# EasyEDA schematic SCH_JamSoftElectronULA.json

## Sheets
1 Power: TITLE: POWER; REV: 3.1; Date: 2024-04-19; Sheet: 1/3; Drawn By: Chris Jamieson; Company: JamSoft
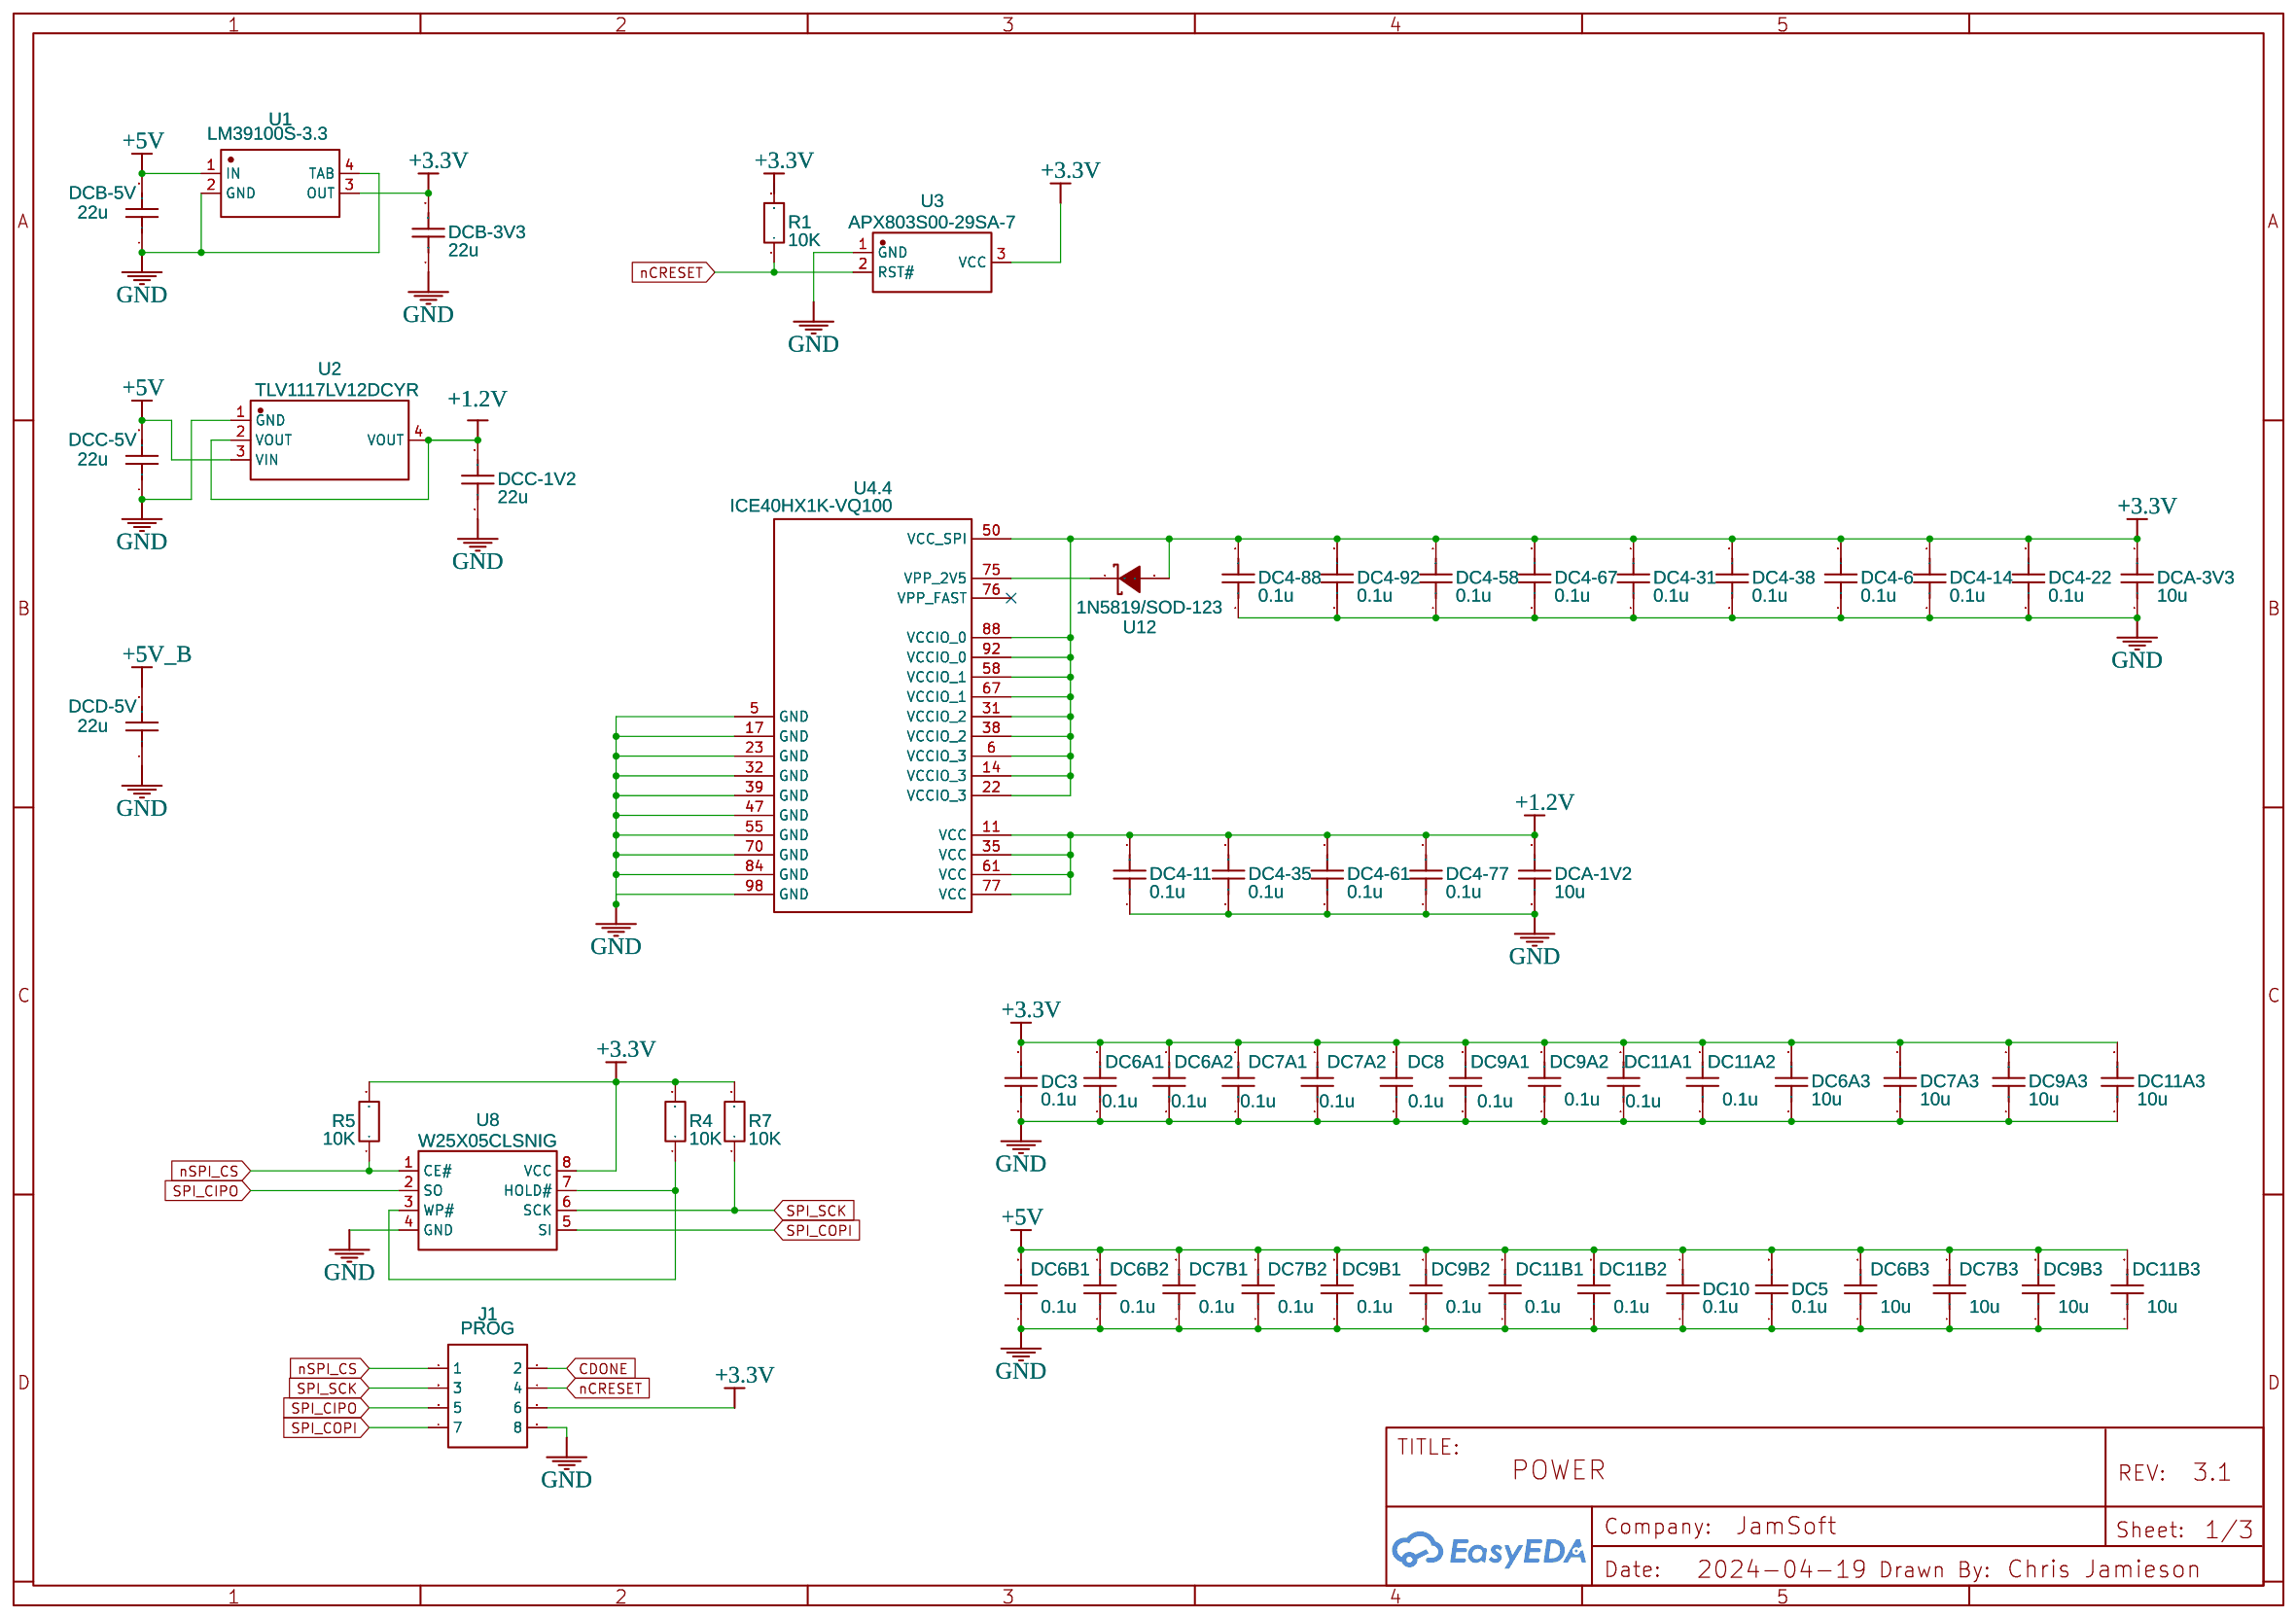
[diagram p0: Power]
2 ULA1: TITLE: ULA1; Sheet: 2/3
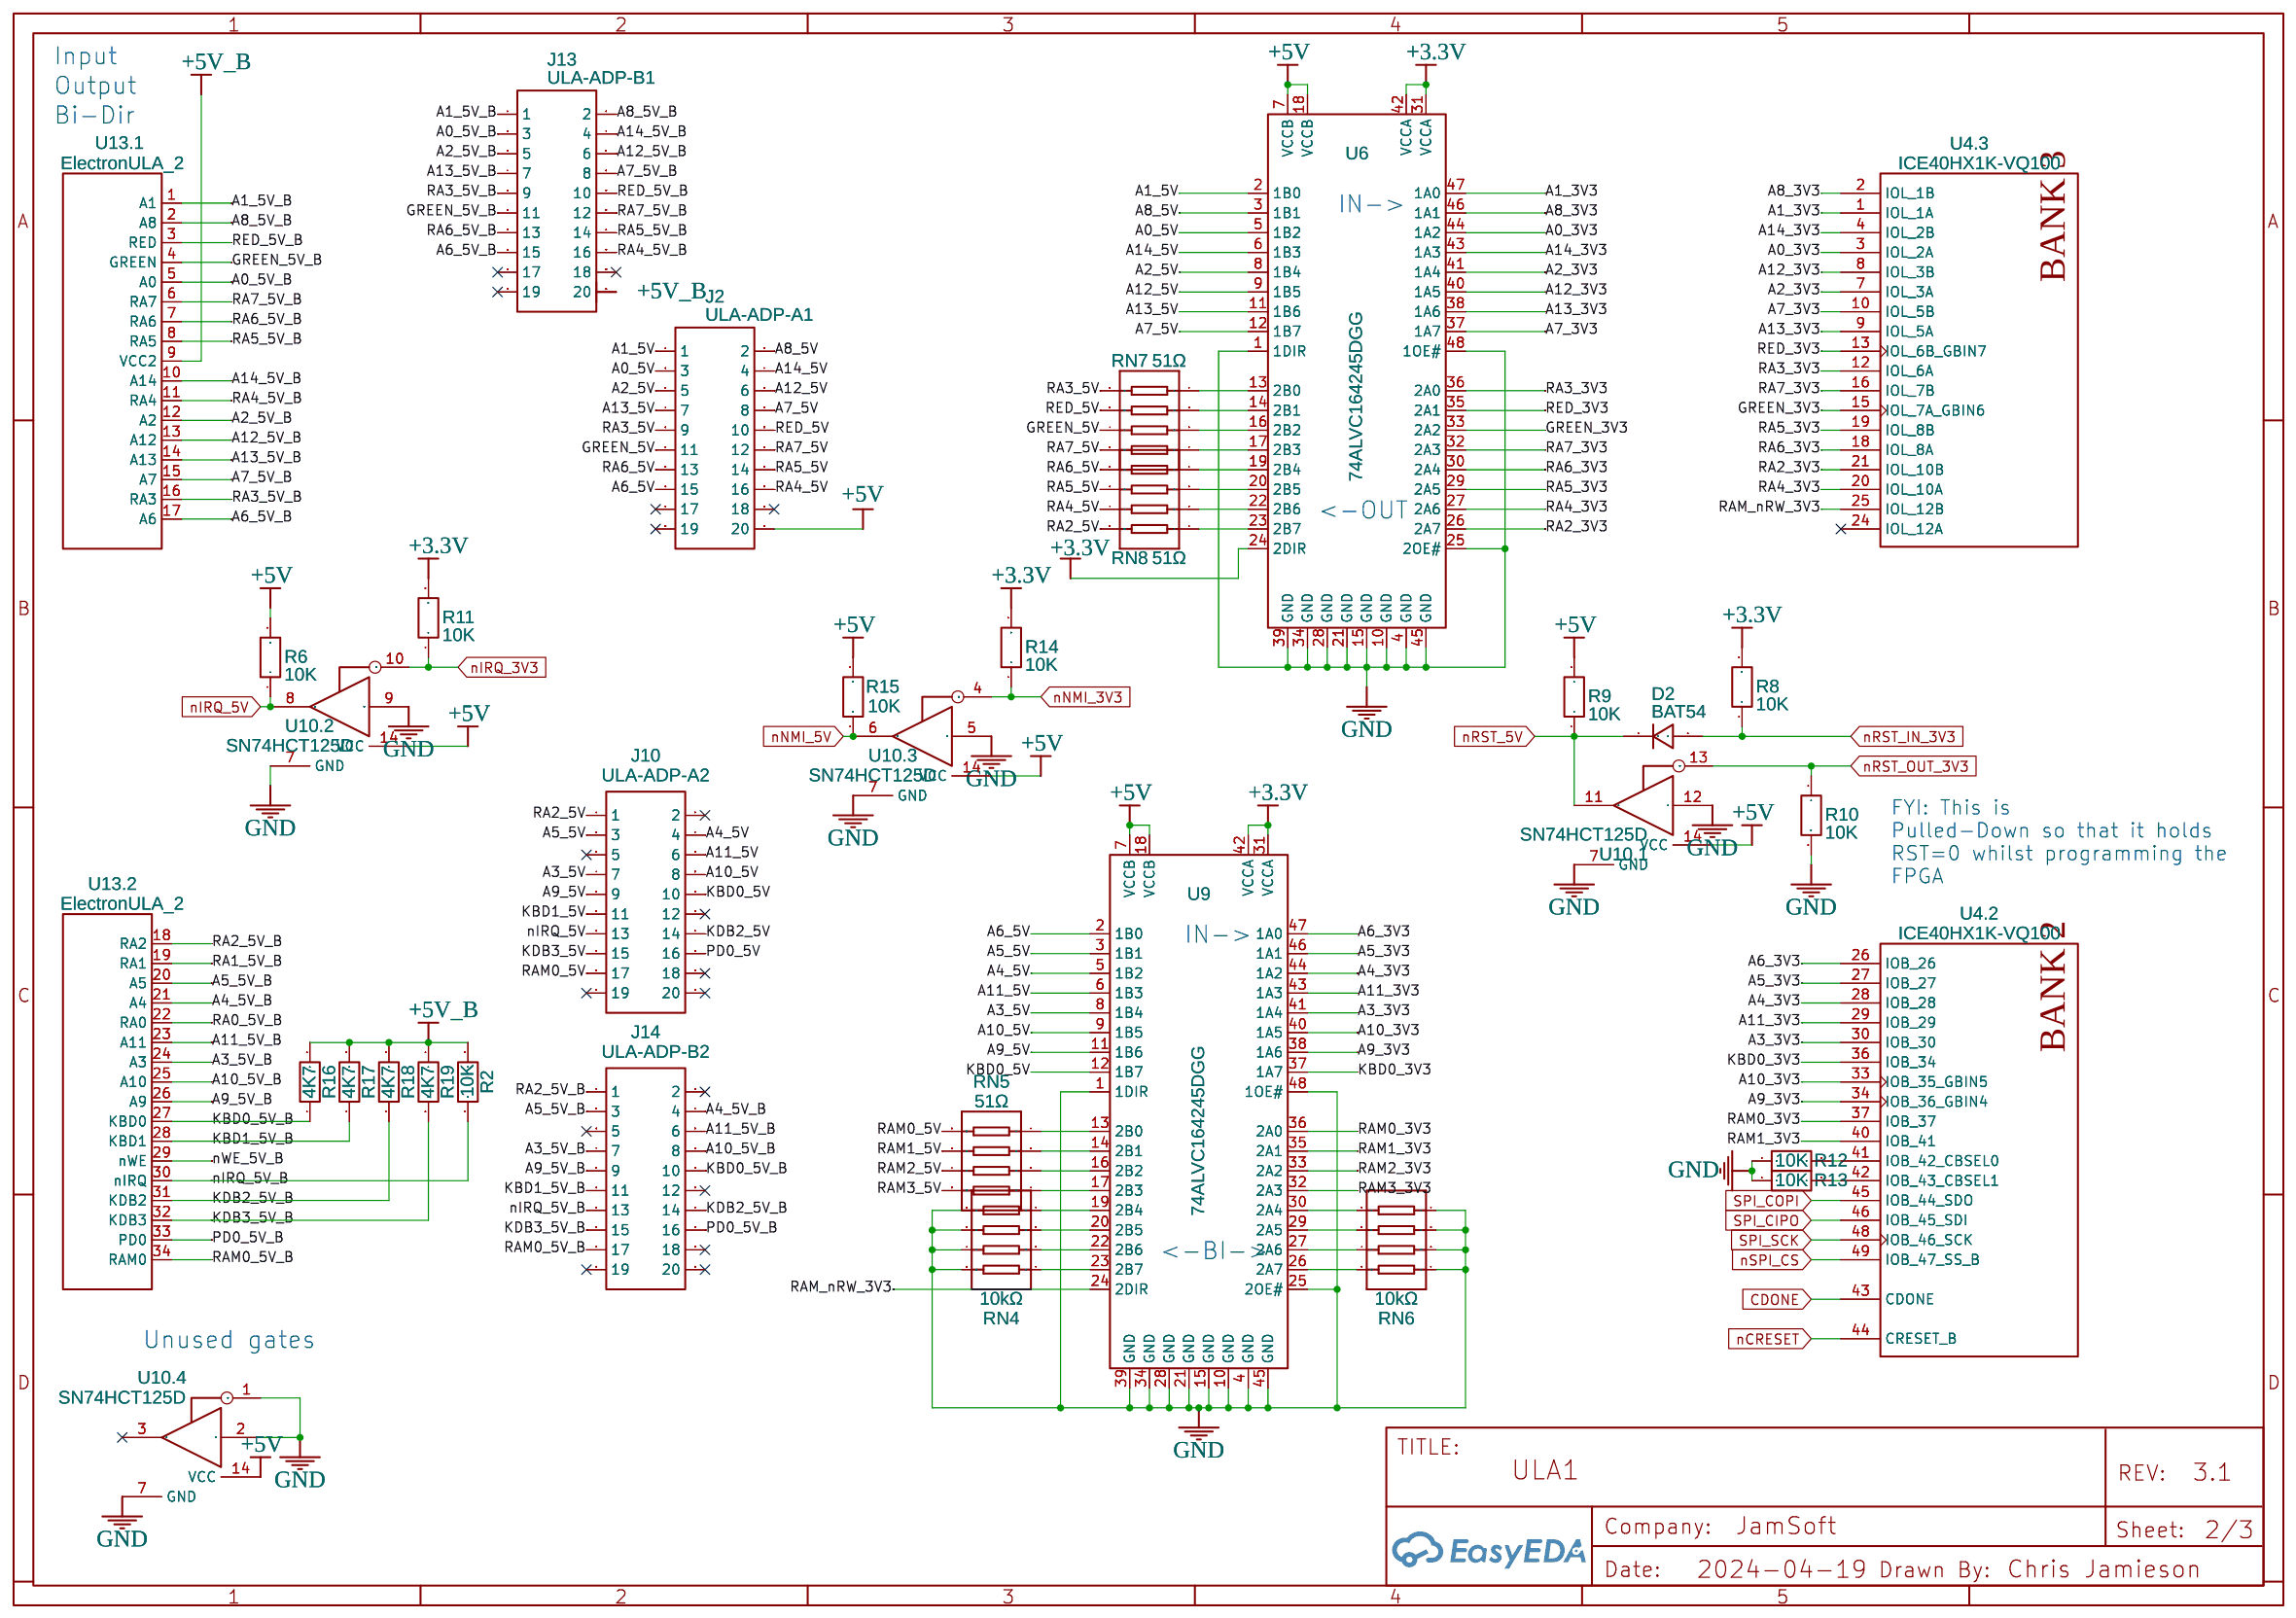
[diagram p1: ULA1]
3 ULA2: TITLE: ULA2; Sheet: 3/3
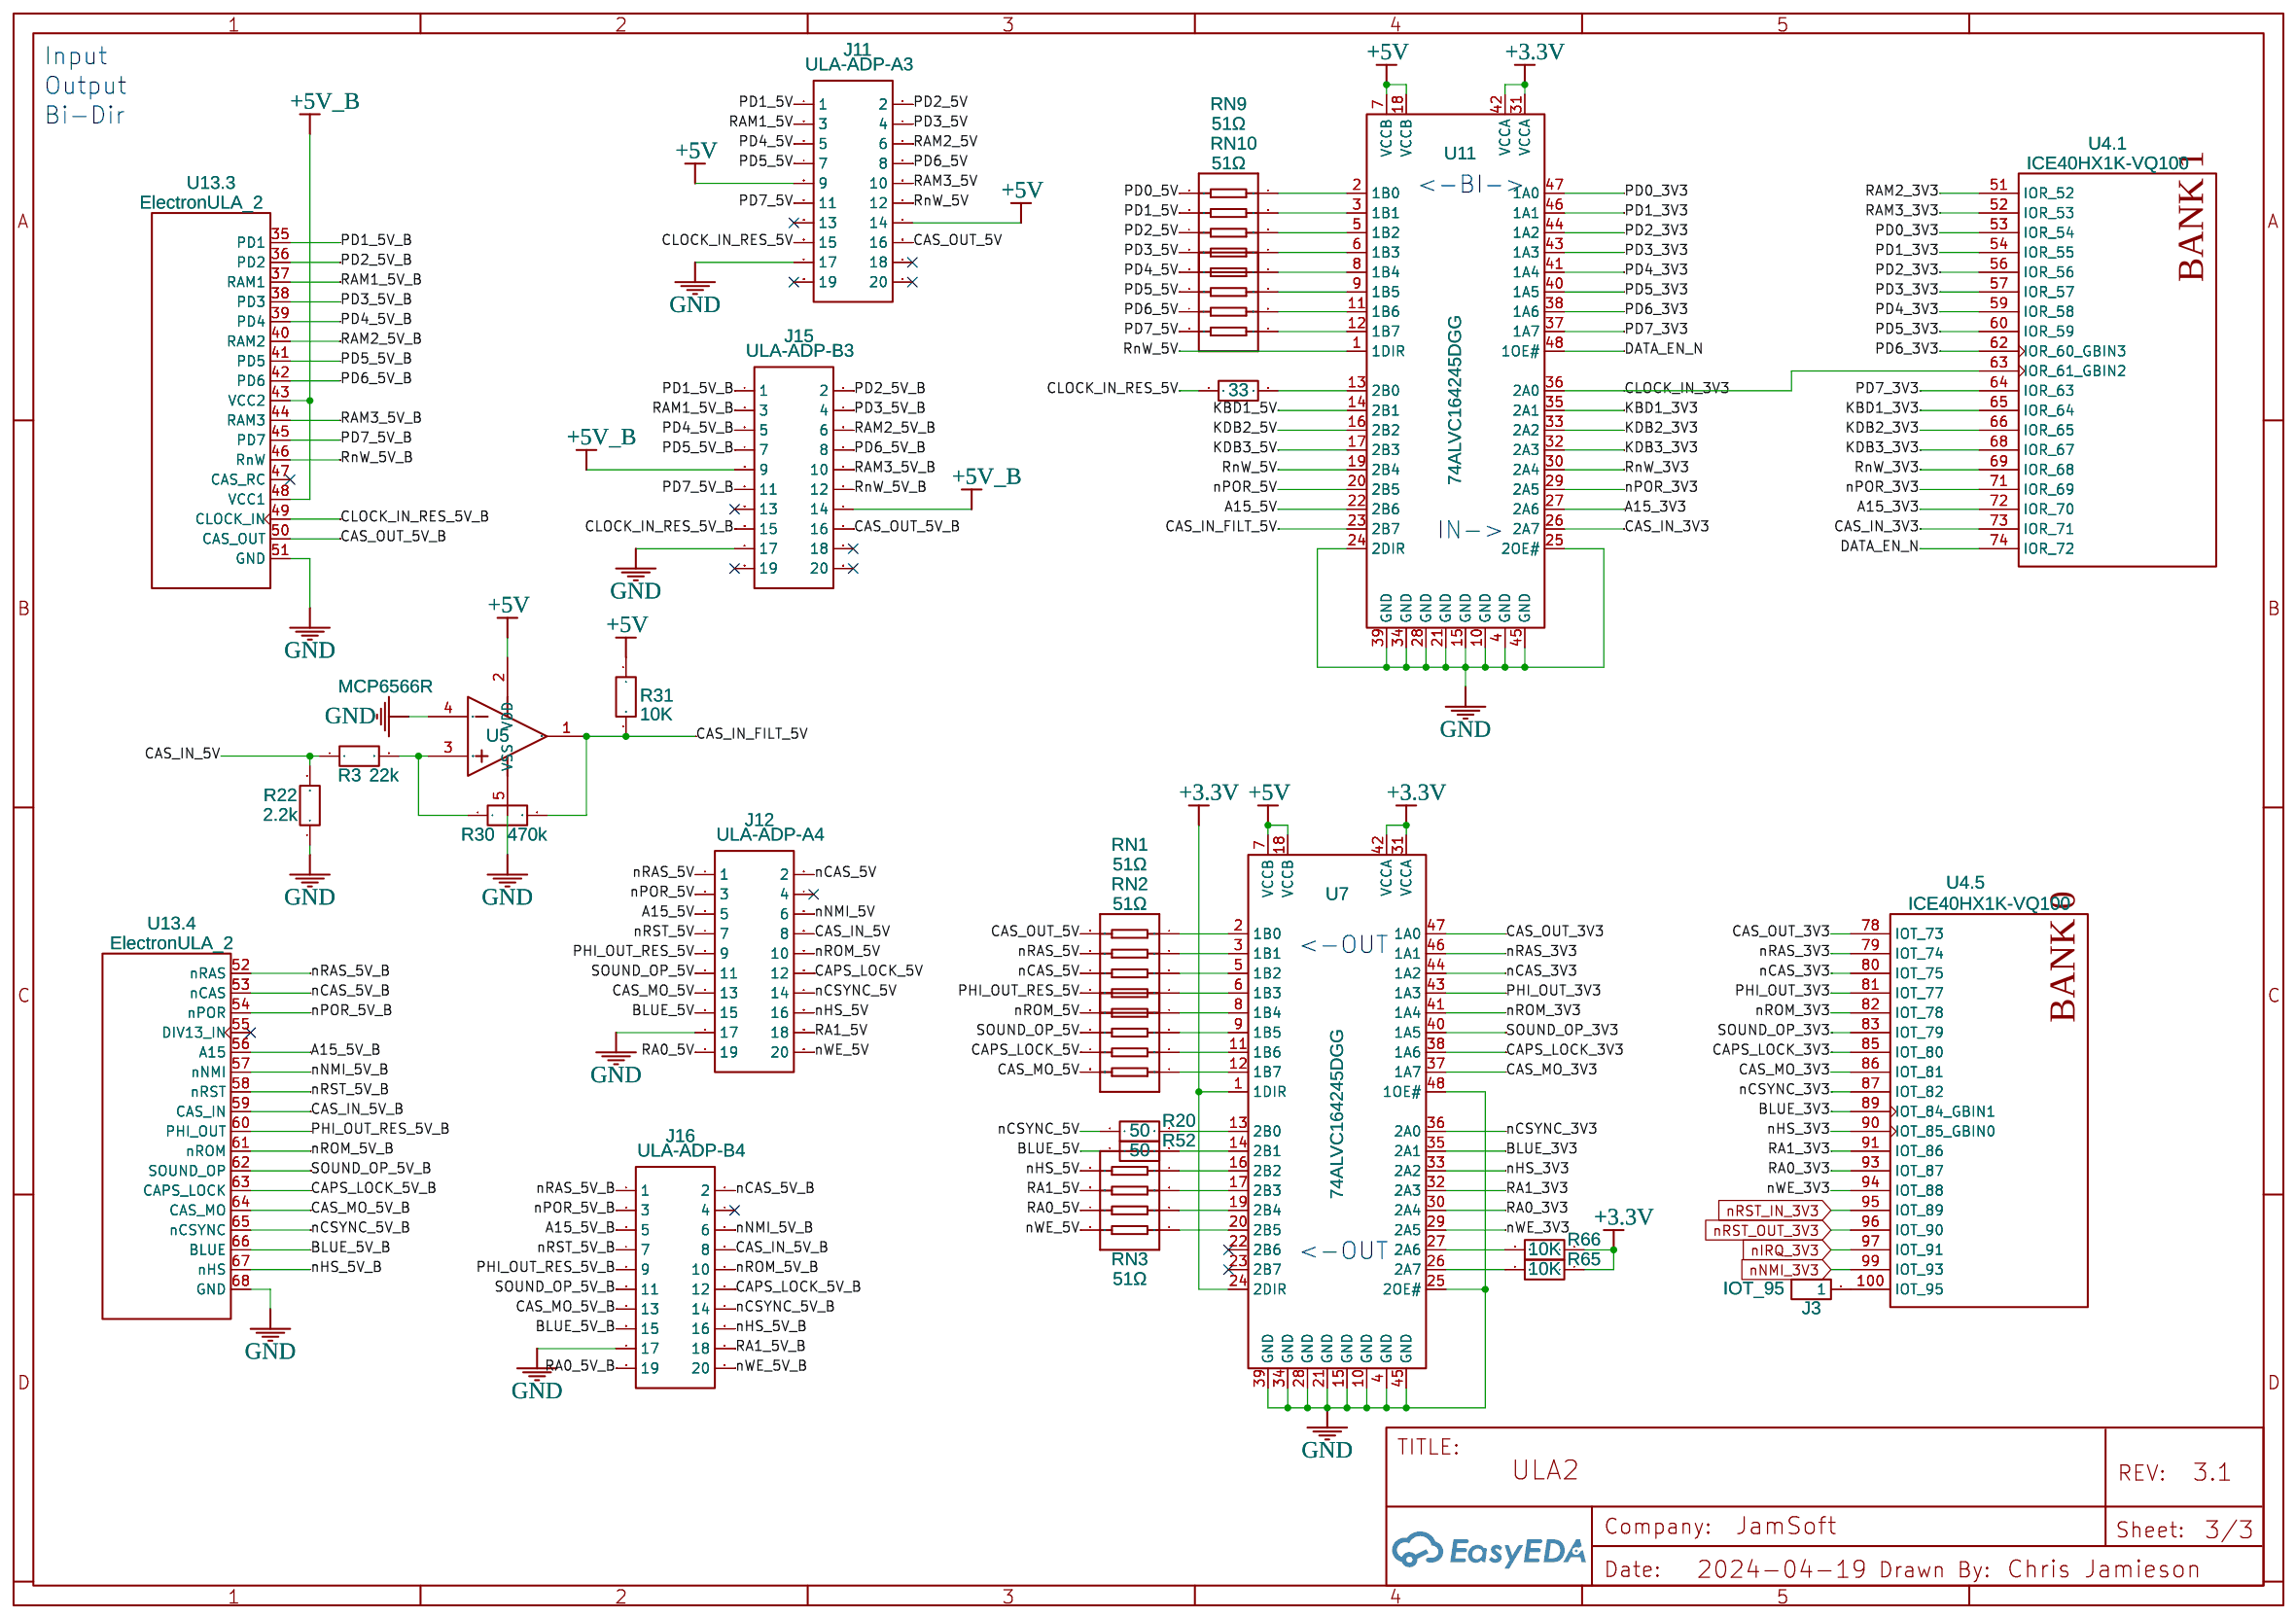
[diagram p2: ULA2]

## Parts
sheet Power
DC3  0.1u  [C0402]
DC4-6  0.1u  [C0402]
DC4-11  0.1u  [C0402]
DC4-14  0.1u  [C0402]
DC4-22  0.1u  [C0402]
DC4-31  0.1u  [C0402]
DC4-35  0.1u  [C0402]
DC4-38  0.1u  [C0402]
DC4-58  0.1u  [C0402]
DC4-61  0.1u  [C0402]
DC4-67  0.1u  [C0402]
DC4-77  0.1u  [C0402]
DC4-88  0.1u  [C0402]
DC4-92  0.1u  [C0402]
DC5  0.1u  [C0402]
DC6A1  0.1u  [C0402]
DC6A2  0.1u  [C0402]
DC6A3  10u  [C0402]
DC6B1  0.1u  [C0402]
DC6B2  0.1u  [C0402]
DC6B3  10u  [C0402]
DC7A1  0.1u  [C0402]
DC7A2  0.1u  [C0402]
DC7A3  10u  [C0402]
DC7B1  0.1u  [C0402]
DC7B2  0.1u  [C0402]
DC7B3  10u  [C0402]
DC8  0.1u  [C0402]
DC9A1  0.1u  [C0402]
DC9A2  0.1u  [C0402]
DC9A3  10u  [C0402]
DC9B1  0.1u  [C0402]
DC9B2  0.1u  [C0402]
DC9B3  10u  [C0402]
DC10  0.1u  [C0402]
DC11A1  0.1u  [C0402]
DC11A2  0.1u  [C0402]
DC11A3  10u  [C0402]
DC11B1  0.1u  [C0402]
DC11B2  0.1u  [C0402]
DC11B3  10u  [C0402]
DCA-1V2  10u  [C0402]
DCA-3V3  10u  [C0402]
DCB-3V3  22u  [C0603]
DCB-5V  22u  [C0603]
DCC-1V2  22u  [C0603]
DCC-5V  22u  [C0603]
DCD-5V  22u  [C0603]
J1  PROG  [HDR-M-2.54_2X4]
R1  10K  [R0402]
R4  10K  [R0402]
R5  10K  [R0402]
R7  10K  [R0402]
U1  LM39100S-3.3  [SOT-223_L6.5-W3.5-P2.30-LS7.0-BR]
U2  TLV1117LV12DCYR  [SOT-223_L6.5-W3.5-P2.30-LS7.0-BR]
U3  APX803S00-29SA-7  [SOT-23-3_L2.9-W1.3-P1.90-LS2.4-BR]
U8  W25X05CLSNIG  [SOIC-8_L4.9-W3.9-P1.27-LS6.0-BL]
U12  1N5819/SOD-123  [SOD-123_L2.7-W1.7-LS3.8-RD]
sheet ULA1
D2  BAT54  [D_SOD-323_HANDSOLDERING]
J2  ULA-ADP-A1  [HDR-M-2.54_2X10]
J10  ULA-ADP-A2  [HDR-M-2.54_2X10]
J13  ULA-ADP-B1  [HDR-M-2.54_2X10]
J14  ULA-ADP-B2  [HDR-M-2.54_2X10]
R2  10K  [R0402]
R6  10K  [R0402]
R8  10K  [R0402]
R9  10K  [R0402]
R10  10K  [R0402]
R11  10K  [R0402]
R12  10K  [R0402]
R13  10K  [R0402]
R14  10K  [R0402]
R15  10K  [R0402]
R16  4K7  [R0402]
R17  4K7  [R0402]
R18  4K7  [R0402]
R19  4K7  [R0402]
RN4  10kΩ  [RES-ARRAY-SMD_0804-8P-L2.0-W1.0-BL]
RN5  51Ω  [RES-ARRAY-SMD_0804-8P-L2.0-W1.0-BL]
RN6  10kΩ  [RES-ARRAY-SMD_0804-8P-L2.0-W1.0-BL]
RN7  51Ω  [RES-ARRAY-SMD_0804-8P-L2.0-W1.0-BL]
RN8  51Ω  [RES-ARRAY-SMD_0804-8P-L2.0-W1.0-BL]
U6  74ALVC164245DGG  [TSSOP-48_L12.6-W6.2-P0.50-LS8.1-BL]
U9  74ALVC164245DGG  [TSSOP-48_L12.6-W6.2-P0.50-LS8.1-BL]
U10  SN74HCT125D  [TSSOP14]  (sections 1,2,3,4)
U13  ElectronULA_2  [PGA-68_L29.5-W29.5-P2.54-BL_ELECTRON_ULA]  (sections 1,2,3,4)
sheet ULA2
J3  IOT_95  [HDR-M-2.54_1X1]
J11  ULA-ADP-A3  [HDR-M-2.54_2X10]
J12  ULA-ADP-A4  [HDR-M-2.54_2X10]
J15  ULA-ADP-B3  [HDR-M-2.54_2X10]
J16  ULA-ADP-B4  [HDR-M-2.54_2X10]
R3  22k  [R0402]
R20  50  [R0402]
R21  33  [R0402]
R22  2.2k  [R0402]
R30  470k  [R0402]
R31  10K  [R0402]
R52  50  [R0402]
R65  10K  [R0402]
R66  10K  [R0402]
RN1  51Ω  [RES-ARRAY-SMD_0804-8P-L2.0-W1.0-BL]
RN2  51Ω  [RES-ARRAY-SMD_0804-8P-L2.0-W1.0-BL]
RN3  51Ω  [RES-ARRAY-SMD_0804-8P-L2.0-W1.0-BL]
RN9  51Ω  [RES-ARRAY-SMD_0804-8P-L2.0-W1.0-BL]
RN10  51Ω  [RES-ARRAY-SMD_0804-8P-L2.0-W1.0-BL]
U4  ICE40HX1K-VQ100  [LATC-VQFP-100]  (sections 1,2,3,4,5)
U5  MCP6566R  [SOT-23-5_L3.0-W1.7-P0.95-LS2.8-BR]
U7  74ALVC164245DGG  [TSSOP-48_L12.6-W6.2-P0.50-LS8.1-BL]
U11  74ALVC164245DGG  [TSSOP-48_L12.6-W6.2-P0.50-LS8.1-BL]

## Library data of the parts
DC3 DC4-6 DC4-11 DC4-14 DC4-22 DC4-31 DC4-35 DC4-38 DC4-58 DC4-61 DC4-67 DC4-77 DC4-88 DC4-92 DC5 DC6A1 DC6A2 DC6B1 DC6B2 DC7A1 DC7A2 DC7B1 DC7B2 DC8 DC9A1 DC9A2 DC9B1 DC9B2 DC10 DC11A1 DC11A2 DC11B1 DC11B2 = C_0603_US: Supplier Part: C1525; Supplier: JLCPCB; Contributor: LCEDA_Lib
DC6A3 DC6B3 DC7A3 DC7B3 DC9A3 DC9B3 DC11A3 DC11B3 DCA-1V2 DCA-3V3 = C_0603_US: Supplier Part: C15525; Supplier: JLCPCB; Contributor: LCEDA_Lib
DCB-3V3 DCB-5V DCC-1V2 DCC-5V DCD-5V = C_0603_US: Supplier Part: C59461; Supplier: JLCPCB; Contributor: LCEDA_Lib
J1 = HDR-M-2.54_2x4: Supplier Part: C18198018; Supplier: LCSC; Contributor: LCEDA_Lib
R1 R2 R4-R15 R31 R65 R66 = R_0603_EU: Supplier Part: C25744; Supplier: JLCPCB; Contributor: LCEDA_Lib
U1 = MIC37100-3.3WS: Supplier: LCSC; Manufacturer: HTC Korea TAEJIN Tech; Contributor: LCSC; Supplier Part: C126055; JLCPCB Part Class: Extended Part
U2 = NCP565ST12T3G: Supplier: LCSC; Supplier Part: C80106; Manufacturer: Texas Instruments; Contributor: LCSC; JLCPCB Part Class: Extended Part
U3 = APX803S00-29SA-7: Supplier: LCSC; Supplier Part: C526392; Manufacturer: Diodes Incorporated; Contributor: LCSC; JLCPCB Part Class: Extended Part
U8 = SST26VF080A-104I/SN: Supplier: LCSC; Supplier Part: C401657; Manufacturer: Winbond; Manufacturer Part: W25X05CLSNIG TR; link: https://atta.szlcsc.com/upload/public/pdf/source/20210531/C1012895_033BAE174785005372D44D8E41779E1D.pdf; Contributor: Chris Jamieson
U12 = 1N5819/SOD-123: Supplier: JLCPCB; Supplier Part: C81598; Manufacturer: ST(Semtech); Manufacturer Part: 1N4148W; Contributor: LCSC
D2 = 1N4007W: Supplier: LCSC; Supplier Part: C179609; Manufacturer: onsemi; Manufacturer Part: NSVBAT54HT1G; Contributor: LCEDA_Lib
J2 J10-J12 = HDR-M-2.54_2x10: Supplier Part: C7494883; Supplier: LCSC; Contributor: LCEDA_Lib
J13-J16 = HDR-M-2.54_2x10: Contributor: LCEDA_Lib
R16-R19 = R_0603_EU: Supplier Part: C25900; Supplier: JLCPCB; Contributor: LCEDA_Lib
RN4 RN6 = CAY10-101J4LF: Contributor: Chris Jamieson; Supplier: LCSC; Supplier Part: C1731037; Manufacturer: BOURNS; Manufacturer Part: CAY10-103J4LF; JLCPCB Part Class: Extended Part
RN1-RN3 RN5 RN7-RN10 = CAT10-510J4LF: Contributor: Chris Jamieson; Supplier: LCSC; Supplier Part: C148527; Manufacturer: BOURNS; JLCPCB Part Class: Extended Part
U6 U7 U9 U11 = 74ALVC164245DGG:11: Supplier: LCSC; Manufacturer: Nexperia; Supplier Part: C5531; JLCPCB Part Class: Extended Part; Contributor: Chris Jamieson
U10 = HD74HCT125T: Quad Bus Buffer Gates with 3-State Outputs; subpart_no: 1; Manufacturer Part: 74HCT125PW,118; Supplier: LCSC; Supplier Part: C131316; Manufacturer: Nexperia
U13 = ElectronULA_2: Supplier Part: C5156444; Supplier: LCSC; Contributor: Chris Jamieson; subpart_no: 1
J3 = HDR-M-2.54_1x1: Contributor: LCEDA_Lib
R3 = R_0402_EU: Supplier Part: C25768; Supplier: JLCPCB; Contributor: LCEDA_Lib
R20 R52 = R_AXIAL-0.4_EU: Supplier Part: C25120; Supplier: JLCPCB; Contributor: LCEDA_Lib
R21 = R_0603_EU: Supplier Part: C25105; Supplier: JLCPCB; Contributor: LCEDA_Lib
R22 = R_0402_EU: Supplier Part: C25879; Supplier: JLCPCB; Contributor: LCEDA_Lib
R30 = R_0402_EU: Supplier Part: C25790; Supplier: JLCPCB; Contributor: LCEDA_Lib
U4 = ICE40HX1K-VQ100: iCE40 HX1K Series FPGA Family, 1280 Logic Cells, 1.2 V Core, 64 K Embedded RAM Bits, 100-pin VQFP, Pb-Free, Tray; subpart_no: 5; Supplier: LCSC; Supplier Part: C1519043; Manufacturer: Lattice
U5 = MCP6566T-E/OT: Supplier: LCSC; Manufacturer: Microchip Tech; Manufacturer Part: MCP6566RT-E/OT; Contributor: LCSC; Supplier Part: C623507; JLCPCB Part Class: Extended Part

## Nets
+1.2V: DC4-11.2 DC4-35.2 DC4-61.2 DC4-77.2 DCA-1V2.2 DCC-1V2.2 U2.2(VOUT) U2.4(VOUT) U4.11(VCC) U4.35(VCC) U4.61(VCC) U4.77(VCC)
+3.3V: DC3.2 DC4-6.2 DC4-14.2 DC4-22.2 DC4-31.2 DC4-38.2 DC4-58.2 DC4-67.2 DC4-88.2 DC4-92.2 DC6A1.2 DC6A2.2 DC6A3.2 DC7A1.2 DC7A2.2 DC7A3.2 DC8.2 DC9A1.2 DC9A2.2 DC9A3.2 DC11A1.2 DC11A2.2 DC11A3.2 DCA-3V3.2 DCB-3V3.2 J1.6 R1.2 R4.2 R5.2 R7.2 R8.2 R11.2 R14.2 R65.1 R66.1 U1.3(OUT) U3.3(VCC) U4.6(VCCIO_3) U4.14(VCCIO_3) U4.22(VCCIO_3) U4.31(VCCIO_2) U4.38(VCCIO_2) U4.50(VCC_SPI) U4.58(VCCIO_1) U4.67(VCCIO_1) U4.88(VCCIO_0) U4.92(VCCIO_0) U6.24(2DIR) U6.31(VCCA) U6.42(VCCA) U7.1(1DIR) U7.24(2DIR) U7.31(VCCA) U7.42(VCCA) U8.8(VCC) U9.31(VCCA) U9.42(VCCA) U11.31(VCCA) U11.42(VCCA) U12.2(A)
+5V: DC5.2 DC6B1.2 DC6B2.2 DC6B3.2 DC7B1.2 DC7B2.2 DC7B3.2 DC9B1.2 DC9B2.2 DC9B3.2 DC10.2 DC11B1.2 DC11B2.2 DC11B3.2 DCB-5V.2 DCC-5V.2 J2.20 J11.9 J11.14 R6.2 R9.2 R15.2 R31.1 U1.1(IN) U2.3(VIN) U5.2(VDD) U6.7(VCCB) U6.18(VCCB) U7.7(VCCB) U7.18(VCCB) U9.7(VCCB) U9.18(VCCB) U10.14(VCC) U11.7(VCCB) U11.18(VCCB)
+5V_B: DCD-5V.2 J13.20 J15.9 J15.14 R2.2 R16.2 R17.2 R18.2 R19.1 U13.9(VCC2) U13.43(VCC2) U13.48(VCC1)
GND: DC3.1 DC4-6.1 DC4-11.1 DC4-14.1 DC4-22.1 DC4-31.1 DC4-35.1 DC4-38.1 DC4-58.1 DC4-61.1 DC4-67.1 DC4-77.1 DC4-88.1 DC4-92.1 DC5.1 DC6A1.1 DC6A2.1 DC6A3.1 DC6B1.1 DC6B2.1 DC6B3.1 DC7A1.1 DC7A2.1 DC7A3.1 DC7B1.1 DC7B2.1 DC7B3.1 DC8.1 DC9A1.1 DC9A2.1 DC9A3.1 DC9B1.1 DC9B2.1 DC9B3.1 DC10.1 DC11A1.1 DC11A2.1 DC11A3.1 DC11B1.1 DC11B2.1 DC11B3.1 DCA-1V2.1 DCA-3V3.1 DCB-3V3.1 DCB-5V.1 DCC-1V2.1 DCC-5V.1 DCD-5V.1 J1.8 J11.17 J12.17 J15.17 J16.17 R10.2 R12.1 R13.1 R22.1 RN4.5 RN4.6 RN4.7 RN4.8 RN6.1 RN6.2 RN6.3 RN6.4 U1.2(GND) U1.4(TAB) U2.1(GND) U3.1(GND) U4.5(GND) U4.17(GND) U4.23(GND) U4.32(GND) U4.39(GND) U4.47(GND) U4.55(GND) U4.70(GND) U4.84(GND) U4.98(GND) U5.4(VIN-) U5.5(VSS) U6.1(1DIR) U6.4(GND) U6.10(GND) U6.15(GND) U6.21(GND) U6.25(2OE#) U6.28(GND) U6.34(GND) U6.39(GND) U6.45(GND) U6.48(1OE#) U7.4(GND) U7.10(GND) U7.15(GND) U7.21(GND) U7.25(2OE#) U7.28(GND) U7.34(GND) U7.39(GND) U7.45(GND) U7.48(1OE#) U8.4(GND) U9.1(1DIR) U9.4(GND) U9.10(GND) U9.15(GND) U9.21(GND) U9.25(2OE#) U9.28(GND) U9.34(GND) U9.39(GND) U9.45(GND) U9.48(1OE#) U10.1(1C) U10.2(1A) U10.5(2A) U10.7(GND) U10.9(3A) U10.12(4A) U11.4(GND) U11.10(GND) U11.15(GND) U11.21(GND) U11.24(2DIR) U11.25(2OE#) U11.28(GND) U11.34(GND) U11.39(GND) U11.45(GND) U13.51(GND) U13.68(GND)
A0_3V3: U4.3(IOL_2A) U6.44(1A2)
A0_5V: J2.3 U6.5(1B2)
A0_5V_B: J13.3 U13.5(A0)
A1_3V3: U4.1(IOL_1A) U6.47(1A0)
A1_5V: J2.1 U6.2(1B0)
A1_5V_B: J13.1 U13.1(A1)
A2_3V3: U4.7(IOL_3A) U6.41(1A4)
A2_5V: J2.5 U6.8(1B4)
A2_5V_B: J13.5 U13.12(A2)
A3_3V3: U4.30(IOB) U9.41(1A4)
A3_5V: J10.7 U9.8(1B4)
A3_5V_B: J14.7 U13.24(A3)
A4_3V3: U4.28(IOB) U9.44(1A2)
A4_5V: J10.4 U9.5(1B2)
A4_5V_B: J14.4 U13.21(A4)
A5_3V3: U4.27(IOB) U9.46(1A1)
A5_5V: J10.3 U9.3(1B1)
A5_5V_B: J14.3 U13.20(A5)
A6_3V3: U4.26(IOB) U9.47(1A0)
A6_5V: J2.15 U9.2(1B0)
A6_5V_B: J13.15 U13.17(A6)
A7_3V3: U4.10(IOL_5B) U6.37(1A7)
A7_5V: J2.8 U6.12(1B7)
A7_5V_B: J13.8 U13.15(A7)
A8_3V3: U4.2(IOL_1B) U6.46(1A1)
A8_5V: J2.2 U6.3(1B1)
A8_5V_B: J13.2 U13.2(A8)
A9_3V3: U4.34(IOB_36_GBIN4) U9.38(1A6)
A9_5V: J10.9 U9.11(1B6)
A9_5V_B: J14.9 U13.26(A9)
A10_3V3: U4.33(IOB_35_GBIN5) U9.40(1A5)
A10_5V: J10.8 U9.9(1B5)
A10_5V_B: J14.8 U13.25(A10)
A11_3V3: U4.29(IOB) U9.43(1A3)
A11_5V: J10.6 U9.6(1B3)
A11_5V_B: J14.6 U13.23(A11)
A12_3V3: U4.8(IOL_3B) U6.40(1A5)
A12_5V: J2.6 U6.9(1B5)
A12_5V_B: J13.6 U13.13(A12)
A13_3V3: U4.9(IOL_5A) U6.38(1A6)
A13_5V: J2.7 U6.11(1B6)
A13_5V_B: J13.7 U13.14(A13)
A14_3V3: U4.4(IOL_2B) U6.43(1A3)
A14_5V: J2.4 U6.6(1B3)
A14_5V_B: J13.4 U13.10(A14)
A15_3V3: U4.72(IOR_70) U11.27(2A6)
A15_5V: J12.5 U11.22(2B6)
A15_5V_B: J16.5 U13.56(A15)
BLUE_3V3: U4.89(IOT_84_GBIN1) U7.35(2A1)
BLUE_5V: J12.15 R52.1
BLUE_5V_B: J16.15 U13.66(BLUE)
CAPS_LOCK_3V3: U4.85(IOT_80) U7.38(1A6)
CAPS_LOCK_5V: J12.12 RN2.7
CAPS_LOCK_5V_B: J16.12 U13.63(CAPS_LOCK)
CAS_IN_3V3: U4.73(IOR_71) U11.26(2A7)
CAS_IN_5V: J12.8 R3.1 R22.2
CAS_IN_5V_B: J16.8 U13.59(CAS_IN)
CAS_IN_FILT_5V: R30.2 R31.2 U5.1(OUT) U11.23(2B7)
CAS_MO_3V3: U4.86(IOT_81) U7.37(1A7)
CAS_MO_5V: J12.13 RN2.8
CAS_MO_5V_B: J16.13 U13.64(CAS_MO)
CAS_OUT_3V3: U4.78(IOT_73) U7.47(1A0)
CAS_OUT_5V: J11.16 RN1.5
CAS_OUT_5V_B: J15.16 U13.50(CAS_OUT)
CDONE: J1.2 U4.43(CDONE)
CLOCK_IN_3V3: U4.63(IOR_61_GBIN2) U11.36(2A0)
CLOCK_IN_RES_5V: J11.15 R21.1
CLOCK_IN_RES_5V_B: J15.15 U13.49(CLOCK_IN)
DATA_EN_N: U4.74(IOR_72) U11.48(1OE#)
GREEN_3V3: U4.15(IOL_7A_GBIN6) U6.33(2A2)
GREEN_5V: J2.11 RN7.7
GREEN_5V_B: J13.11 U13.4(GREEN)
KBD0_3V3: U4.36(IOB_34) U9.37(1A7)
KBD0_5V: J10.10 U9.12(1B7)
KBD0_5V_B: J14.10 R16.1 U13.27(KBD0)
KBD1_3V3: U4.65(IOR_64) U11.35(2A1)
KBD1_5V: J10.11 U11.14(2B1)
KBD1_5V_B: J14.11 R17.1 U13.28(KBD1)
KDB2_3V3: U4.66(IOR_65) U11.33(2A2)
KDB2_5V: J10.14 U11.16(2B2)
KDB2_5V_B: J14.14 R18.1 U13.31(KDB2)
KDB3_3V3: U4.68(IOR_67) U11.32(2A3)
KDB3_5V: J10.15 U11.17(2B3)
KDB3_5V_B: J14.15 R19.2 U13.32(KDB3)
nCAS_3V3: U4.80(IOT_75) U7.44(1A2)
nCAS_5V: J12.2 RN1.7
nCAS_5V_B: J16.2 U13.53(nCAS)
nCRESET: J1.4 R1.1 U3.2(RST#) U4.44(CRESET_B)
nCSYNC_3V3: U4.87(IOT_82) U7.36(2A0)
nCSYNC_5V: J12.14 R20.1
nCSYNC_5V_B: J16.14 U13.65(nCSYNC)
nHS_3V3: U4.90(IOT_85_GBIN0) U7.33(2A2)
nHS_5V: J12.16 RN3.5
nHS_5V_B: J16.16 U13.67(nHS)
nIRQ_3V3: R11.1 U4.97(IOT_91) U10.10(3C)
nIRQ_5V: J10.13 R6.1 U10.8(3Y)
nIRQ_5V_B: J14.13 R2.1 U13.30(nIRQ)
nNMI_3V3: R14.1 U4.99(IOT_93) U10.4(2C)
nNMI_5V: J12.6 R15.1 U10.6(2Y)
nNMI_5V_B: J16.6 U13.57(nNMI)
nPOR_3V3: U4.71(IOR_69) U11.29(2A5)
nPOR_5V: J12.3 U11.20(2B5)
nPOR_5V_B: J16.3 U13.54(nPOR)
nRAS_3V3: U4.79(IOT_74) U7.46(1A1)
nRAS_5V: J12.1 RN1.6
nRAS_5V_B: J16.1 U13.52(nRAS)
nROM_3V3: U4.82(IOT_78) U7.41(1A4)
nROM_5V: J12.10 RN2.5
nROM_5V_B: J16.10 U13.61(nROM)
nRST_5V: D2.1 J12.7 R9.1 U10.11(4Y)
nRST_5V_B: J16.7 U13.58(nRST)
nRST_IN_3V3: D2.2 R8.1 U4.95(IOT_89)
nRST_OUT_3V3: R10.1 U4.96(IOT_90) U10.13(4C)
nSPI_CS: J1.1 R5.1 U4.49(IOB_47_SS_B) U8.1(CE#)
nWE_3V3: U4.94(IOT_88) U7.29(2A5)
nWE_5V: J12.20 RN3.8
nWE_5V_B: J16.20 U13.29(nWE)
PD0_3V3: U4.53(IOR_54) U11.47(1A0)
PD0_5V: J10.16 RN9.5
PD0_5V_B: J14.16 U13.33(PD0)
PD1_3V3: U4.54(IOR_55) U11.46(1A1)
PD1_5V: J11.1 RN9.6
PD1_5V_B: J15.1 U13.35(PD1)
PD2_3V3: U4.56(IOR) U11.44(1A2)
PD2_5V: J11.2 RN9.7
PD2_5V_B: J15.2 U13.36(PD2)
PD3_3V3: U4.57(IOR) U11.43(1A3)
PD3_5V: J11.4 RN9.8
PD3_5V_B: J15.4 U13.38(PD3)
PD4_3V3: U4.59(IOR_58) U11.41(1A4)
PD4_5V: J11.5 RN10.5
PD4_5V_B: J15.5 U13.39(PD4)
PD5_3V3: U4.60(IOR_59) U11.40(1A5)
PD5_5V: J11.7 RN10.6
PD5_5V_B: J15.7 U13.41(PD5)
PD6_3V3: U4.62(IOR_60_GBIN3) U11.38(1A6)
PD6_5V: J11.8 RN10.7
PD6_5V_B: J15.8 U13.42(PD6)
PD7_3V3: U4.64(IOR_63) U11.37(1A7)
PD7_5V: J11.11 RN10.8
PD7_5V_B: J15.11 U13.45(PD7)
PHI_OUT_3V3: U4.81(IOT_77) U7.43(1A3)
PHI_OUT_RES_5V: J12.9 RN1.8
PHI_OUT_RES_5V_B: J16.9 U13.60(PHI_OUT)
RA0_3V3: U4.93(IOT_87) U7.30(2A4)
RA0_5V: J12.19 RN3.7
RA0_5V_B: J16.19 U13.22(RA0)
RA1_3V3: U4.91(IOT_86) U7.32(2A3)
RA1_5V: J12.18 RN3.6
RA1_5V_B: J16.18 U13.19(RA1)
RA2_3V3: U4.21(IOL_10B) U6.26(2A7)
RA2_5V: J10.1 RN8.8
RA2_5V_B: J14.1 U13.18(RA2)
RA3_3V3: U4.12(IOL_6A) U6.36(2A0)
RA3_5V: J2.9 RN7.5
RA3_5V_B: J13.9 U13.16(RA3)
RA4_3V3: U4.20(IOL_10A) U6.27(2A6)
RA4_5V: J2.16 RN8.7
RA4_5V_B: J13.16 U13.11(RA4)
RA5_3V3: U4.19(IOL_8B) U6.29(2A5)
RA5_5V: J2.14 RN8.6
RA5_5V_B: J13.14 U13.8(RA5)
RA6_3V3: U4.18(IOL_8A) U6.30(2A4)
RA6_5V: J2.13 RN8.5
RA6_5V_B: J13.13 U13.7(RA6)
RA7_3V3: U4.16(IOL_7B) U6.32(2A3)
RA7_5V: J2.12 RN7.8
RA7_5V_B: J13.12 U13.6(RA7)
RAM0_3V3: U4.37(IOB) U9.36(2A0)
RAM0_5V: J10.17 RN5.5
RAM0_5V_B: J14.17 U13.34(RAM0)
RAM1_3V3: U4.40(IOB_41) U9.35(2A1)
RAM1_5V: J11.3 RN5.6
RAM1_5V_B: J15.3 U13.37(RAM1)
RAM2_3V3: U4.51(IOR_52) U9.33(2A2)
RAM2_5V: J11.6 RN5.7
RAM2_5V_B: J15.6 U13.40(RAM2)
RAM3_3V3: U4.52(IOR_53) U9.32(2A3)
RAM3_5V: J11.10 RN5.8
RAM3_5V_B: J15.10 U13.44(RAM3)
RAM_nRW_3V3: U4.25(IOL_12B) U9.24(2DIR)
RED_3V3: U4.13(IOL_6B_GBIN7) U6.35(2A1)
RED_5V: J2.10 RN7.6
RED_5V_B: J13.10 U13.3(RED)
RnW_3V3: U4.69(IOR_68) U11.30(2A4)
RnW_5V: J11.12 U11.1(1DIR) U11.19(2B4)
RnW_5V_B: J15.12 U13.46(RnW)
SOUND_OP_3V3: U4.83(IOT_79) U7.40(1A5)
SOUND_OP_5V: J12.11 RN2.6
SOUND_OP_5V_B: J16.11 U13.62(SOUND_OP)
SPI_CIPO: J1.5 U4.46(IOB_45_SDI) U8.2(SO)
SPI_COPI: J1.7 U4.45(IOB_44_SDO) U8.5(SI)
SPI_SCK: J1.3 R7.1 U4.48(IOB_46_SCK) U8.6(SCK)
Net-(J3-1): J3.1 U4.100(IOT_95)
Net-(R3-2): R3.2 R30.1 U5.3(VIN+)
Net-(R4-1): R4.1 U8.3(WP#) U8.7(HOLD#)
Net-(R12-2): R12.2 U4.41(IOB_42_CBSEL0)
Net-(R13-2): R13.2 U4.42(IOB_43_CBSEL1)
Net-(R20-2): R20.2 U7.13(2B0)
Net-(R21-2): R21.2 U11.13(2B0)
Net-(R52-2): R52.2 U7.14(2B1)
Net-(R65-2): R65.2 U7.26(2A7)
Net-(R66-2): R66.2 U7.27(2A6)
Net-(RN1-1): RN1.1 U7.6(1B3)
Net-(RN1-2): RN1.2 U7.5(1B2)
Net-(RN1-3): RN1.3 U7.3(1B1)
Net-(RN1-4): RN1.4 U7.2(1B0)
Net-(RN2-1): RN2.1 U7.12(1B7)
Net-(RN2-2): RN2.2 U7.11(1B6)
Net-(RN2-3): RN2.3 U7.9(1B5)
Net-(RN2-4): RN2.4 U7.8(1B4)
Net-(RN3-1): RN3.1 U7.20(2B5)
Net-(RN3-2): RN3.2 U7.19(2B4)
Net-(RN3-3): RN3.3 U7.17(2B3)
Net-(RN3-4): RN3.4 U7.16(2B2)
Net-(RN4-1): RN4.1 U9.23(2B7)
Net-(RN4-2): RN4.2 U9.22(2B6)
Net-(RN4-3): RN4.3 U9.20(2B5)
Net-(RN4-4): RN4.4 U9.19(2B4)
Net-(RN5-1): RN5.1 U9.17(2B3)
Net-(RN5-2): RN5.2 U9.16(2B2)
Net-(RN5-3): RN5.3 U9.14(2B1)
Net-(RN5-4): RN5.4 U9.13(2B0)
Net-(RN6-5): RN6.5 U9.30(2A4)
Net-(RN6-6): RN6.6 U9.29(2A5)
Net-(RN6-7): RN6.7 U9.27(2A6)
Net-(RN6-8): RN6.8 U9.26(2A7)
Net-(RN7-1): RN7.1 U6.17(2B3)
Net-(RN7-2): RN7.2 U6.16(2B2)
Net-(RN7-3): RN7.3 U6.14(2B1)
Net-(RN7-4): RN7.4 U6.13(2B0)
Net-(RN8-1): RN8.1 U6.23(2B7)
Net-(RN8-2): RN8.2 U6.22(2B6)
Net-(RN8-3): RN8.3 U6.20(2B5)
Net-(RN8-4): RN8.4 U6.19(2B4)
Net-(RN9-1): RN9.1 U11.6(1B3)
Net-(RN9-2): RN9.2 U11.5(1B2)
Net-(RN9-3): RN9.3 U11.3(1B1)
Net-(RN9-4): RN9.4 U11.2(1B0)
Net-(RN10-1): RN10.1 U11.12(1B7)
Net-(RN10-2): RN10.2 U11.11(1B6)
Net-(RN10-3): RN10.3 U11.9(1B5)
Net-(RN10-4): RN10.4 U11.8(1B4)
Net-(U4.4-75): U4.75(VPP_2V5) U12.1(C)

Not connected (* = marked no-connect by the designer): J2 17* 18* 19*; J10 2* 5* 12* 18* 19* 20*; J11 13* 18* 19* 20*; J12 4*; J13 17* 18* 19*; J14 2* 5* 12* 18* 19* 20*; J15 13* 18* 19* 20*; J16 4*; U4 24(IOL_12A)* 76(VPP_FAST)*; U7 22(2B6)* 23(2B7)*; U10 3(1Y)*; U13 47(CAS_RC)* 55(DIV13_IN)*

## Notes on the sheets
sheet 2
- Input
- Output
- Bi-Dir
- IN->
- <-OUT
- FYI: This is
  Pulled-Down so that it holds
  RST=0 whilst programming the
  FPGA
- IN->
- <-BI->
- Unused gates
sheet 3
- Input
- Output
- Bi-Dir
- <-BI->
- IN->
- <-OUT
- <-OUT
